# Altium project Synthdude.PrjPcb
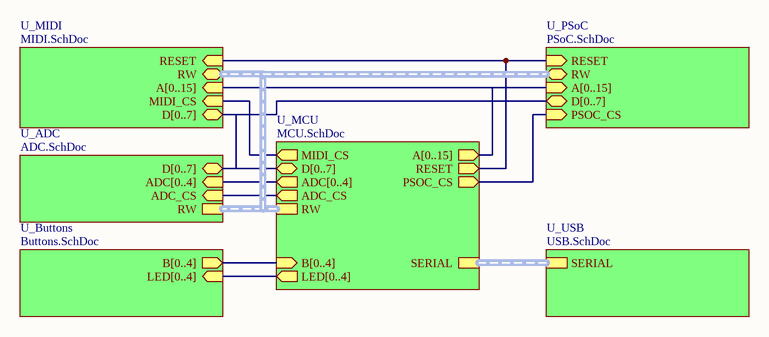
[diagram p0: Synthdude.SchDoc]
7 sheets, 124 parts. Net scope: hierarchical (ports join the sheet entries above them; power ports are global).
Board file: Synthdude.PcbDoc
Sheets:
  Synthdude.SchDoc
    U_MCU = MCU.SchDoc
    U_MIDI = MIDI.SchDoc
    U_USB = USB.SchDoc
    U_PSoC = PSoC.SchDoc
    U_Buttons = Buttons.SchDoc
    U_ADC = ADC.SchDoc

## Sheet Synthdude.SchDoc
size A; SheetNumber: 1; SheetTotal: 7

### Sub-sheets
U_ADC = ADC.SchDoc: D[0..7] (bidir), ADC[0..4] (in), RW (harness RW), ADC_CS (in)
U_Buttons = Buttons.SchDoc: B[0..4] (out), LED[0..4] (in)
U_MCU = MCU.SchDoc: D[0..7] (bidir), A[0..15] (out), SERIAL (harness UART), ADC_CS (out), MIDI_CS (out), PSOC_CS (out), RW (harness RW), ADC[0..4] (out), RESET (out), B[0..4] (in), LED[0..4] (out)
U_MIDI = MIDI.SchDoc: D[0..7] (bidir), MIDI_CS (in), A[0..15] (in), RESET (in), RW (harness RW)
U_PSoC = PSoC.SchDoc: D[0..7] (bidir), PSOC_CS (in), RESET (in), A[0..15] (in), RW (harness RW)
U_USB = USB.SchDoc: SERIAL (harness UART)

### Nets
NetU1_13: sheet U_MCU/ADC_CS, sheet U_ADC/ADC_CS
NetU8_4: sheet U_MCU/RESET, sheet U_MIDI/RESET, sheet U_PSoC/RESET
NetU13_12: sheet U_MCU/PSOC_CS, sheet U_PSoC/PSOC_CS
NetU13_13: sheet U_MCU/MIDI_CS, sheet U_MIDI/MIDI_CS

### Buses and harness runs
bus sheet U_ADC/ADC[0..4] = sheet U_MCU/ADC[0..4]
bus sheet U_ADC/D[0..7] = sheet U_MCU/D[0..7] = sheet U_MIDI/D[0..7] = sheet U_PSoC/D[0..7]
bus sheet U_Buttons/B[0..4] = sheet U_MCU/B[0..4]
bus sheet U_Buttons/LED[0..4] = sheet U_MCU/LED[0..4]
bus sheet U_MCU/A[0..15] = sheet U_MIDI/A[0..15] = sheet U_PSoC/A[0..15]
harness sheet U_ADC/RW = sheet U_MCU/RW = sheet U_MIDI/RW = sheet U_PSoC/RW
harness sheet U_MCU/SERIAL = sheet U_USB/SERIAL

## Sheet MCU.SchDoc
size A; SheetNumber: 2; SheetTotal: 7
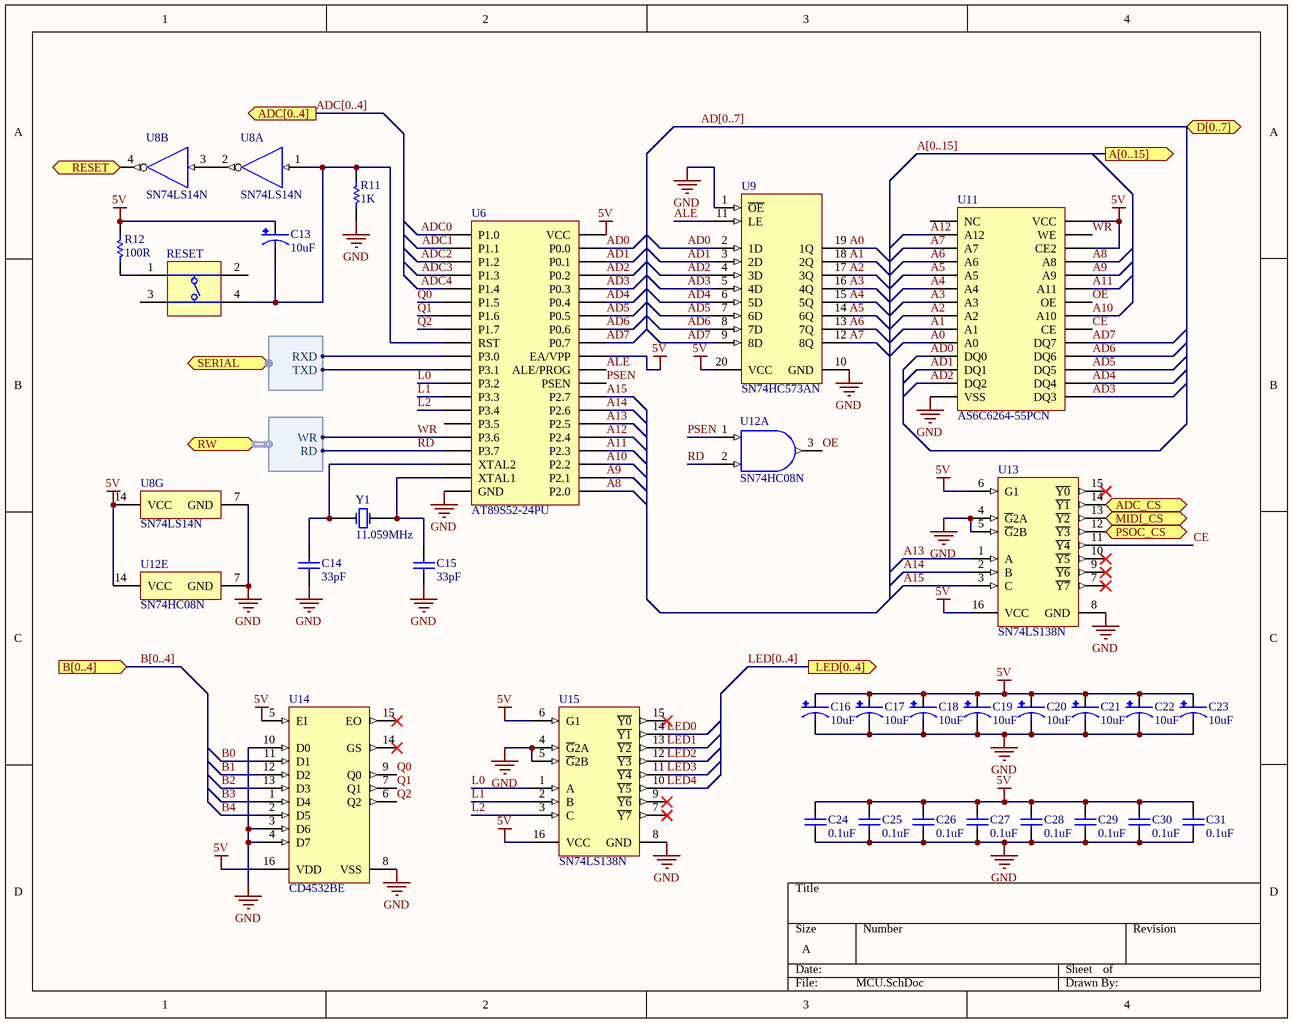
[diagram p1: MCU.SchDoc]

### Parts
C13  10uF  [CPOL-RADIAL]
C14  33pF  [CAP-PTH]
C15  33pF  [CAP-PTH]
C16  10uF  [CPOL-RADIAL]
C17  10uF  [CPOL-RADIAL]
C18  10uF  [CPOL-RADIAL]
C19  10uF  [CPOL-RADIAL]
C20  10uF  [CPOL-RADIAL]
C21  10uF  [CPOL-RADIAL]
C22  10uF  [CPOL-RADIAL]
C23  10uF  [CPOL-RADIAL]
C24  0.1uF  [CAP-PTH]
C25  0.1uF  [CAP-PTH]
C26  0.1uF  [CAP-PTH]
C27  0.1uF  [CAP-PTH]
C28  0.1uF  [CAP-PTH]
C29  0.1uF  [CAP-PTH]
C30  0.1uF  [CAP-PTH]
C31  0.1uF  [CAP-PTH]
R11  1K  [RESISTOR]
R12  100R  [RESISTOR]
RESET  (no value)  [TACTILE_SWITCH]
U6  AT89S52-24PU  [PDIP-40]
U8  SN74LS14N  [N0014A]  (parts A,B,G of 7)
U9  SN74HC573AN  [N0020A]
U11  AS6C6264-55PCN  [PDIP-28]
U12  SN74HC08N  [N0014A]  (parts A,E of 5)
U13  SN74LS138N  [N0016A]
U14  CD4532BE  [N0016A]
U15  SN74LS138N  [N0016A]
Y1  11.059MHz  [CRYSTAL_PTH]

### Ports
A[0..15] (out), ADC[0..4] (out), ADC_CS (out), B[0..4] (in), D[0..7] (bidir), LED[0..4] (out), MIDI_CS (out), PSOC_CS (out), RESET (out), RW (harness RW), SERIAL (harness UART)

### Harnesses
UART: RXD, TXD
RW: WR, RD

### Nets
5V: C13.1(+) C16.1(+) C17.1(+) C18.1(+) C19.1(+) C20.1(+) C21.1(+) C22.1(+) C23.1(+) C24.1 C25.1 C26.1 C27.1 C28.1 C29.1 C30.1 C31.1 R12.2 U6.31(EA/VPP) U6.40(VCC) U8.14(VCC) U9.20(VCC) U11.26(CE2) U11.28(VCC) U12.14(VCC) U13.6(G1) U13.16(VCC) U14.5(EI) U14.16(VDD) U15.6(G1) U15.16(VCC)
GND: C14.2 C15.2 C16.2(-) C17.2(-) C18.2(-) C19.2(-) C20.2(-) C21.2(-) C22.2(-) C23.2(-) C24.2 C25.2 C26.2 C27.2 C28.2 C29.2 C30.2 C31.2 R11.1 U6.20(GND) U8.7(GND) U9.1(~{OE}) U9.10(GND) U11.14(VSS) U12.7(GND) U13.4(~{G}2A) U13.5(~{G}2B) U13.8(GND) U14.3(D6) U14.4(D7) U14.8(VSS) U14.10(D0) U15.4(~{G}2A) U15.5(~{G}2B) U15.8(GND)
A0: U9.19(1Q) U11.10(A0)
A1: U9.18(2Q) U11.9(A1)
A2: U9.17(3Q) U11.8(A2)
A3: U9.16(4Q) U11.7(A3)
A4: U9.15(5Q) U11.6(A4)
A5: U9.14(6Q) U11.5(A5)
A6: U9.13(7Q) U11.4(A6)
A7: U9.12(8Q) U11.3(A7)
A8: U6.21(P2.0) U11.25(A8)
A9: U6.22(P2.1) U11.24(A9)
A10: U6.23(P2.2) U11.21(A10)
A11: U6.24(P2.3) U11.23(A11)
A12: U6.25(P2.4) U11.2(A12)
A13: U6.26(P2.5) U13.1(A)
A14: U6.27(P2.6) U13.2(B)
A15: U6.28(P2.7) U13.3(C)
AD0: U6.39(P0.0) U9.2(1D) U11.11(DQ0)
AD1: U6.38(P0.1) U9.3(2D) U11.12(DQ1)
AD2: U6.37(P0.2) U9.4(3D) U11.13(DQ2)
AD3: U6.36(P0.3) U9.5(4D) U11.15(DQ3)
AD4: U6.35(P0.4) U9.6(5D) U11.16(DQ4)
AD5: U6.34(P0.5) U9.7(6D) U11.17(DQ5)
AD6: U6.33(P0.6) U9.8(7D) U11.18(DQ6)
AD7: U6.32(P0.7) U9.9(8D) U11.19(DQ7)
ADC0: U6.1(P1.0)
ADC1: U6.2(P1.1)
ADC2: U6.3(P1.2)
ADC3: U6.4(P1.3)
ADC4: U6.5(P1.4)
ALE: U6.30(ALE/PROG) U9.11(LE)
B0: U14.11(D1)
B1: U14.12(D2)
B2: U14.13(D3)
B3: U14.1(D4)
B4: U14.2(D5)
CE: U11.20(CE) U13.11(~{Y4})
L0: U6.12(P3.2) U15.1(A)
L1: U6.13(P3.3) U15.2(B)
L2: U6.14(P3.4) U15.3(C)
LED0: U15.14(~{Y1})
LED1: U15.13(~{Y2})
LED2: U15.12(~{Y3})
LED3: U15.11(~{Y4})
LED4: U15.10(~{Y5})
OE: U11.22(OE) U12.3(1Y)
PSEN: U6.29(PSEN) U12.1(1A)
Q0: U6.6(P1.5) U14.9(Q0)
Q1: U6.7(P1.6) U14.7(Q1)
Q2: U6.8(P1.7) U14.6(Q2)
RD: U6.17(P3.7) U12.2(1B) ; port RW.RD
WR: U6.16(P3.6) U11.27(WE) ; port RW.WR
NetC13_2: C13.2(-) R11.2 RESET.4(T3) U6.9(RST) U8.1(1A)
NetC14_1: C14.1 U6.18(XTAL2) Y1.1(X1)
NetC15_1: C15.1 U6.19(XTAL1) Y1.2(X2)
NetR12_1: R12.1 RESET.1(T1)
NetU1_13: U13.14(~{Y1}) ; port ADC_CS
NetU6_10: U6.10(P3.0) ; port SERIAL.RXD
NetU6_11: U6.11(P3.1) ; port SERIAL.TXD
NetU8_2: U8.2(~{1Y}) U8.3(2A)
NetU8_4: U8.4(~{2Y}) ; port RESET
NetU13_12: U13.12(~{Y3}) ; port PSOC_CS
NetU13_13: U13.13(~{Y2}) ; port MIDI_CS

Not connected (* = marked no-connect by the designer): RESET 2(T2) 3(T3); U6 15(P3.5); U11 1(NC); U13 7(~{Y7})* 9(~{Y6})* 10(~{Y5})* 15(~{Y0})*; U14 14(GS)* 15(EO)*; U15 7(~{Y7})* 9(~{Y6})* 15(~{Y0})*

### Buses and harness runs
bus A[0..15] = port A[0..15]
bus AD[0..7] = port D[0..7]
bus ADC[0..4] = port ADC[0..4]
bus B[0..4] = port B[0..4]
bus LED[0..4] = port LED[0..4]

### Library data of the parts
C13 C16-C23 = PolarizedCap
C14 C15 C24-C31 = Cap
R11 R12 = Resistor
RESET = Switch: Switch, SPNO Push Button SMD
U6 = AT89S52-24PU: Manufacturer: Atmel; PartNumber: AT89S52-24PU; Mounting Technology: Through Hole; PackageReference: PDIP-40
U8 = CMP-1615-00069-3: Hex schmitt-trigger inverters, N0014A, TUBE; Manufacturer: Texas Instruments; VCC(Max)(V): 5.25; F @ Nom Voltage(Max)(Mhz): 35; Bits(#): 6; Schmitt Trigger: Yes; Rating: Catalog; Output Type: CMOS; Voltage(Nom)(V): 5; Technology Family: LS; VCC(Min)(V): 4.75; Output Drive (IOL/IOH)(Max)(mA): -0.4/8; tpd @ Nom Voltage(Max)(ns): 22; Input Type: TTL; ICC @ Nom Voltage(Max)(mA): 0.06; Code_JEDEC: MS-001; DatasheetVersion: SDLS049B; PackageReference: N0014A; Operating Temperature Range(C): 0 to 70; Generic Part Number: SN74LS14
U9 = CMP-1621-00367-2: Octal Transparent D-Type Latches With 3-State Outputs, N0020A, TUBE; Manufacturer: Texas Instruments; Rating: Catalog; ICC @ Nom Voltage(Max)(mA): 0.08; Logic: True; tpd @ Nom Voltage(Max)(ns): 38; F @ Nom Voltage(Max)(Mhz): 28; Output Logic: Non-inverted; Bits(#): 8; VCC(Max)(V): 6; Output Type: CMOS; VCC(Min)(V): 2; Technology Family: HC; Schmitt Trigger: No; 3-State Output: Yes; Output Drive (IOL/IOH)(Max)(mA): 7.8/-7.8; DatasheetVersion: SCLS147E; PackageReference: N0020A; Operating Temperature Range(C): -40 to 85; Static Current: 0.08; Code_JEDEC: MS-001; Voltage(Nom)(V): 6; Generic Part Number: SN74HC573A; Input Type: CMOS
U11 = AS6C6264-55PCN: Manufacturer: Alliance Memory, Inc.; PartNumber: AS6C6264-55PCN; Mounting Technology: Through Hole; PackageReference: PDIP-28
U12 = CMP-0777-00250-3: Quadruple 2-Input Positive-AND Gates, N0014A, TUBE; Manufacturer: Texas Instruments; Output Type: CMOS; ICC @ Nom Voltage(Max)(mA): 0.02; tpd @ Nom Voltage(Max)(ns): 28; Voltage(Nom)(V): 5; VCC(Min)(V): 2; Technology Family: HC; F @ Nom Voltage(Max)(Mhz): 70; Rating: Catalog; Bits(#): 4; Schmitt Trigger: No; VCC(Max)(V): 6; PackageReference: N0014A; Input Type: CMOS; Generic Part Number: SN74HC08; DatasheetVersion: SCLS081F; Operating Temperature Range(C): -40 to 85
U13 U15 = CMP-1633-00714-2: 3-line to 8-line decoder / demultiplexer, N0016A, TUBE; Manufacturer: Texas Instruments; Voltage(Nom)(V): 5; VCC(Min)(V): 4.75; Schmitt Trigger: No; Bits(#): 8; VCC(Max)(V): 5.25; ICC @ Nom Voltage(Max)(mA): 10; F @ Nom Voltage(Max)(Mhz): 35; Channels(#): 1; Configuration: 3：8; Technology Family: LS; Output Type: TTL; Output Drive (IOL/IOH)(Max)(mA): 8/-0.4; tpd @ Nom Voltage(Max)(ns): 41; Rating: Catalog; Operating Temperature Range(C): 0 to 70; PackageReference: N0016A; DatasheetVersion: SDLS014; Type: Standard; Generic Part Number: SN74LS138; Function: Decoder/Demultiplexer; Input Type: TTL; Code_JEDEC: MS-001
U14 = CMP-1633-00642-2: CMOS 8-Bit Priority Encoder, N0016A, TUBE; Manufacturer: Texas Instruments; Schmitt Trigger: No; Technology Family: CD4000; Rating: Catalog; Bits(#): 8; VCC(Min)(V): 3; ICC @ Nom Voltage(Max)(mA): 0.3; Function: Encoder/Multiplexer; Configuration: 8：4; Output Drive (IOL/IOH)(Max)(mA): 1.5/-1.5; tpd @ Nom Voltage(Max)(ns): 110; Channels(#): 1; VCC(Max)(V): 18; Voltage(Nom)(V): 5,10,15; Generic Part Number: CD4532B; Code_JEDEC: MS-001; F @ Nom Voltage(Max)(Mhz): 8; PackageReference: N0016A; Operating Temperature Range(C): -55 to 125; Type: Standard; DatasheetVersion: SCHS082C; Input Type: CMOS; Output Type: CMOS
Y1 = Crystal

## Sheet MIDI.SchDoc
size A; SheetNumber: 5; SheetTotal: 7
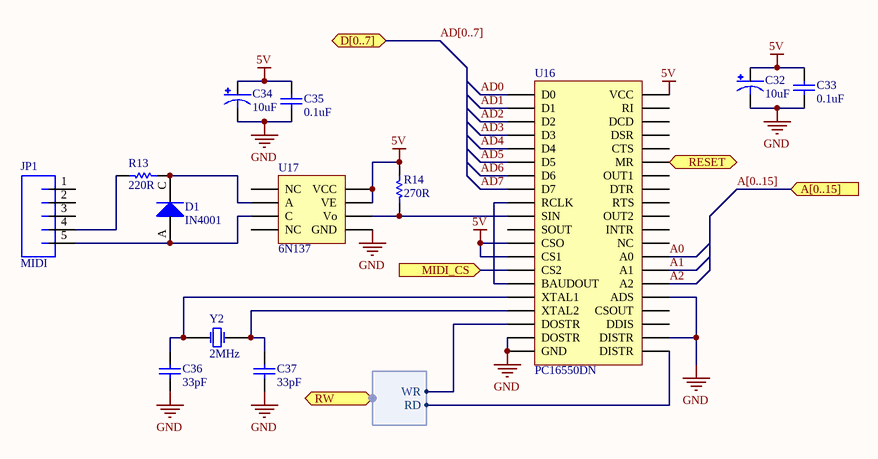
[diagram p2: MIDI.SchDoc]

### Parts
C32  10uF  [CPOL-RADIAL]
C33  0.1uF  [CAP-PTH]
C34  10uF  [CPOL-RADIAL]
C35  0.1uF  [CAP-PTH]
C36  33pF  [CAP-PTH]
C37  33pF  [CAP-PTH]
D1  IN4001  [DIODE-1N4001]
JP1  MIDI  [DIN_5_FEMALE]
R13  220R  [RESISTOR]
R14  270R  [RESISTOR]
U16  PC16550DN  [PDIP-40]
U17  6N137  [PDIP-8]
Y2  2MHz  [CRYSTAL_PTH]

### Ports
A[0..15] (in), D[0..7] (bidir), MIDI_CS (in), RESET (in), RW (harness RW)

### Harnesses
RW: WR, RD

### Nets
5V: C32.1(+) C33.1 C34.1(+) C35.1 R14.2 U16.12(CSO) U16.13(CS1) U16.40(VCC) U17.7(VE) U17.8(VCC)
GND: C32.2(-) C33.2 C34.2(-) C35.2 C36.2 C37.2 U16.19(DOSTR) U16.20(GND) U16.22(DISTR) U16.25(ADS) U17.5(GND)
A0: U16.28(A0)
A1: U16.27(A1)
A2: U16.26(A2)
AD0: U16.1(D0)
AD1: U16.2(D1)
AD2: U16.3(D2)
AD3: U16.4(D3)
AD4: U16.5(D4)
AD5: U16.6(D5)
AD6: U16.7(D6)
AD7: U16.8(D7)
RD: U16.21(DISTR) ; port RW.RD
WR: U16.18(DOSTR) ; port RW.WR
NetC36_1: C36.1 U16.16(XTAL1) Y2.1(X1)
NetC37_1: C37.1 U16.17(XTAL2) Y2.2(X2)
NetD1_A: D1.A JP1.5 U17.3(C)
NetD1_C: D1.C(K) R13.2 U17.2(A)
NetJP1_4: JP1.4 R13.1
NetR14_1: R14.1 U16.10(SIN) U17.6(Vo)
NetU8_4: U16.35(MR) ; port RESET
NetU13_13: U16.14(CS2) ; port MIDI_CS
NetU16_9: U16.9(RCLK) U16.15(BAUDOUT)

Not connected (* = marked no-connect by the designer): JP1 1 2 3; U16 11(SOUT) 23(DDIS) 24(CSOUT) 29(NC) 30(INTR) 31(OUT2) 32(RTS) 33(DTR) 34(OUT1) 36(CTS) 37(DSR) 38(DCD) 39(RI); U17 1(NC) 4(NC)

### Buses and harness runs
bus A[0..15] = port A[0..15]
bus AD[0..7] = port D[0..7]

### Library data of the parts
C32 C34 = PolarizedCap
C33 C35-C37 = Cap
R13 R14 = Resistor
U16 = PC16550DN: Manufacturer: Texas Instruments; PartNumber: PC16550DN; Mounting Technology: Through Hole; PackageReference: PDIP-40
Y2 = Crystal

## Sheet USB.SchDoc
size A; SheetNumber: 7; SheetTotal: 7
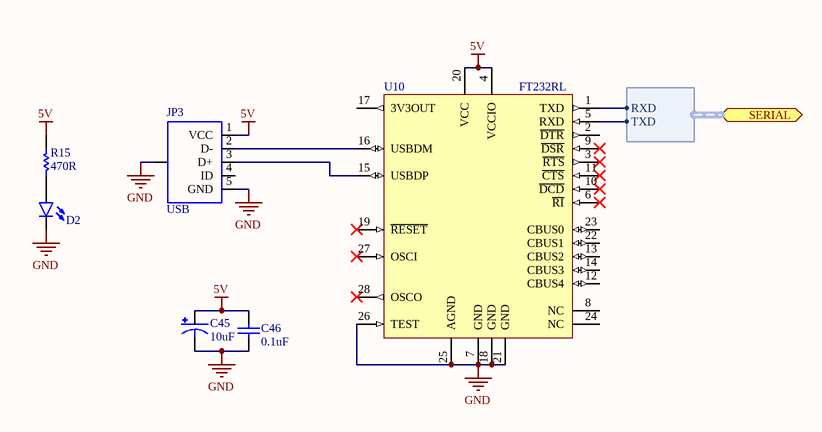
[diagram p3: USB.SchDoc]

### Parts
C45  10uF  [CPOL-RADIAL]
C46  0.1uF  [CAP-PTH]
D2  LED  [LED5MM]  (value not drawn)
JP3  USB  [USB-MICROB]
R15  470R  [RESISTOR]
U10  FT232RL  [SSOP-28_N]

### Ports
SERIAL (harness UART)

### Harnesses
UART: RXD, TXD

### Nets
5V: C45.1(+) C46.1 JP3.1(VCC) R15.1 U10.4(VCCIO) U10.20(VCC)
GND: C45.2(-) C46.2 D2.K JP3.5(GND) JP3.6(SHIELD) U10.7(GND) U10.18(GND) U10.21(GND) U10.25(AGND) U10.26(TEST)
NetD2_A: D2.A R15.2
NetJP3_2: JP3.2(D-) U10.16(USBDM)
NetJP3_3: JP3.3(D+) U10.15(USBDP)
NetU6_10: U10.1(TXD) ; port SERIAL.RXD
NetU6_11: U10.5(RXD) ; port SERIAL.TXD

Not connected (* = marked no-connect by the designer): JP3 4(ID); U10 2(~{DTR}) 3(~{RTS})* 6(~{RI})* 8(NC) 9(~{DSR})* 10(~{DCD})* 11(~{CTS})* 12(CBUS4) 13(CBUS2) 14(CBUS3) 17(3V3OUT) 19(~{RESET})* 22(CBUS1) 23(CBUS0) 24(NC) 27(OSCI)* 28(OSCO)*

### Library data of the parts
C45 = PolarizedCap
C46 = Cap
D2 = LED: PartNumber: LTST-C193TGKT-5A; Manufacturer: Lite-On Inc.; PackageReference: 0603; PackageDescription: 0603 (1608 Metric); Mounting Technology: Surface Mount
JP3 = USB_MICROB_SMT: pin to pad: 1>VBUS 2>D- 3>D+ 4>ID 5>GND 6>MT1+P$1+P$2+MT2; PartNumber: 10118192-0001LF; Manufacturer: Amphenol FCI; Mounting Technology: Surface Mount; PackageReference: USB - Micro B
R15 = Resistor
U10 = CMP-0078-00028-3: USB UART Asynchronous Serial Data Transfer Chip, 28-pin SSOP, Tube; PartNumber: FT232RL-Tube; Manufacturer: FTDI; ComponentLink1Description: Manufacturer URL; ComponentLink2URL: http://www.ftdichip.com/Support/Documents/DataSheets/ICs/DS_FT232R.pdf; PackageVersion: Mar-12; RevisionNote: DatasheetVersion updated to 2.10 Mar-2012; PackageDescription: 28-Pin Small Outline Package 0.65 mm Pitch; PackageReference: SSOP-28; DatasheetVersion: ver 2.10, Mar-2012; ComponentLink2Description: Datasheet; ComponentLink1URL: http://www.ftdichip.com/

## Sheet PSoC.SchDoc
size A; SheetNumber: 6; SheetTotal: 7
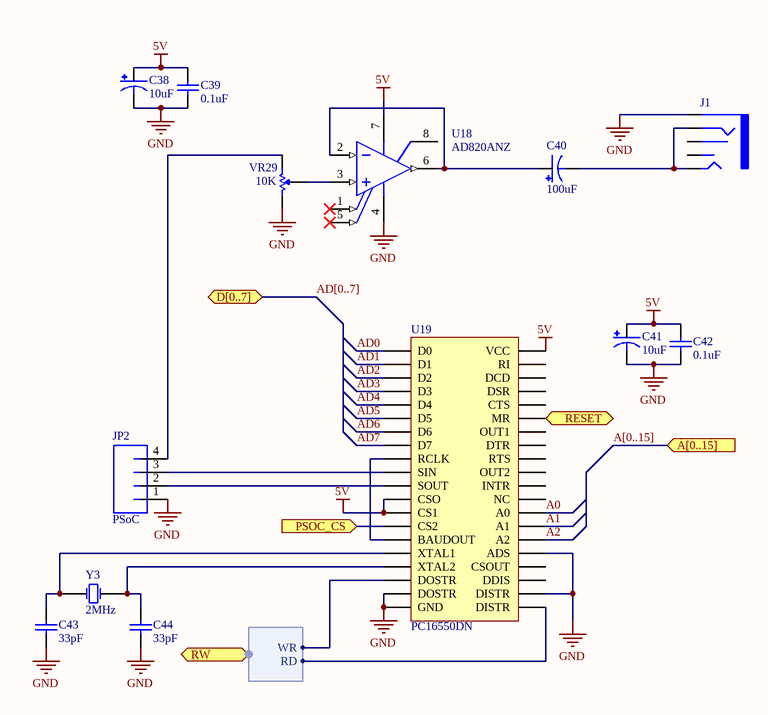
[diagram p4: PSoC.SchDoc]

### Parts
C38  10uF  [CPOL-RADIAL]
C39  0.1uF  [CAP-PTH]
C40  100uF  [CPOL-RADIAL-100UF-25V]
C41  10uF  [CPOL-RADIAL]
C42  0.1uF  [CAP-PTH]
C43  33pF  [CAP-PTH]
C44  33pF  [CAP-PTH]
J1  (no value)  [AUDIO_JACK]
JP2  PSoC  [JST-PH-4-PTH-HORZ]
U18  AD820ANZ  [ADI-N-8]
U19  PC16550DN  [PDIP-40]
VR29  10K  [ROTARY_POT]
Y3  2MHz  [CRYSTAL_PTH]

### Ports
A[0..15] (in), D[0..7] (bidir), PSOC_CS (in), RESET (in), RW (harness RW)

### Harnesses
RW: WR, RD

### Nets
5V: C38.1(+) C39.1 C41.1(+) C42.1 U18.7(+VS) U19.12(CSO) U19.13(CS1) U19.40(VCC)
GND: C38.2(-) C39.2 C41.2(-) C42.2 C43.2 C44.2 J1.SLEEVE JP2.1 U18.4(-VS) U19.19(DOSTR) U19.20(GND) U19.22(DISTR) U19.25(ADS) VR29.3
A0: U19.28(A0)
A1: U19.27(A1)
A2: U19.26(A2)
AD0: U19.1(D0)
AD1: U19.2(D1)
AD2: U19.3(D2)
AD3: U19.4(D3)
AD4: U19.5(D4)
AD5: U19.6(D5)
AD6: U19.7(D6)
AD7: U19.8(D7)
RD: U19.21(DISTR) ; port RW.RD
WR: U19.18(DOSTR) ; port RW.WR
NetC40_1: C40.1(+) U18.2(-IN) U18.6(VOUT)
NetC40_2: C40.2(-) J1.RING J1.TIP
NetC43_1: C43.1 U19.16(XTAL1) Y3.1(X1)
NetC44_1: C44.1 U19.17(XTAL2) Y3.2(X2)
NetJP2_2: JP2.2 U19.11(SOUT)
NetJP2_3: JP2.3 U19.10(SIN)
NetJP2_4: JP2.4 VR29.1
NetU8_4: U19.35(MR) ; port RESET
NetU13_12: U19.14(CS2) ; port PSOC_CS
NetU18_3: U18.3(+IN) VR29.2
NetU19_9: U19.9(RCLK) U19.15(BAUDOUT)

Not connected (* = marked no-connect by the designer): J1 RSH TSH; U18 1(NULL)* 5(NULL)* 8(NC); U19 23(DDIS) 24(CSOUT) 29(NC) 30(INTR) 31(OUT2) 32(RTS) 33(DTR) 34(OUT1) 36(CTS) 37(DSR) 38(DCD) 39(RI)

### Buses and harness runs
bus A[0..15] = port A[0..15]
bus AD[0..7] = port D[0..7]

### Library data of the parts
C38 C41 = PolarizedCap
C39 C42-C44 = Cap
C40 = PolarizedCap-100uF
J1 = AudioJack
JP2 = JST_PH_4_HORZ: PartNumber: S4B-PH-K-S(LF)(SN); Manufacturer: JST Sales America Inc.; PackageReference: JST-PH; Mounting Technology: Through Hole
U18 = CMP-0384-00229-1: Single Channel Rail-to-Rail Operational Amplifier, 1.9 MHz BW, 3 V/us SR, Industrial, 8-pin DIP (N-8), Tube; Manufacturer: Analog Devices; Generic Part Number: AD820; Small Signal Bandwidth: 1.9MHz; V Span Min: 5V; Amplifiers Per Package: 1; V Span Max: 36V; Input Offset Voltage: 100uV; Slew Rate: 3V/us; Input Bias Current: 2pA; Iq/Amp: 900uA; ComponentLink2Description: Datasheet; PackageReference: N-8; Code_JEDEC: MS-001; PartNumber: AD820ANZ; PackageVersion: 070606-A; ComponentLink1URL: http://www.analog.com/en/index.html; PackageDescription: 8-Pin Plastic Dual In-Line Package, Row spacing 7.62 mm, Pitch 2.54 mm; DatasheetVersion: Rev. H; ComponentLink3URL: http:/www.analog.com/static/imported-files/packages/PKG_PDF/PDIP(N)/N_8.pdf; ComponentLink2URL: http://www.analog.com/static/imported-files/data_sheets/AD820.pdf; Mounting Technology: Through Hole; ComponentLink3Description: Package Specification; ComponentLink1Description: Manufacturer URL
U19 = PC16550DN: Manufacturer: Texas Instruments; PartNumber: PC16550DN; Mounting Technology: Through Hole; PackageReference: PDIP-40
VR29 = RotaryPot
Y3 = Crystal

## Sheet Buttons.SchDoc
size A; SheetNumber: 4; SheetTotal: 7
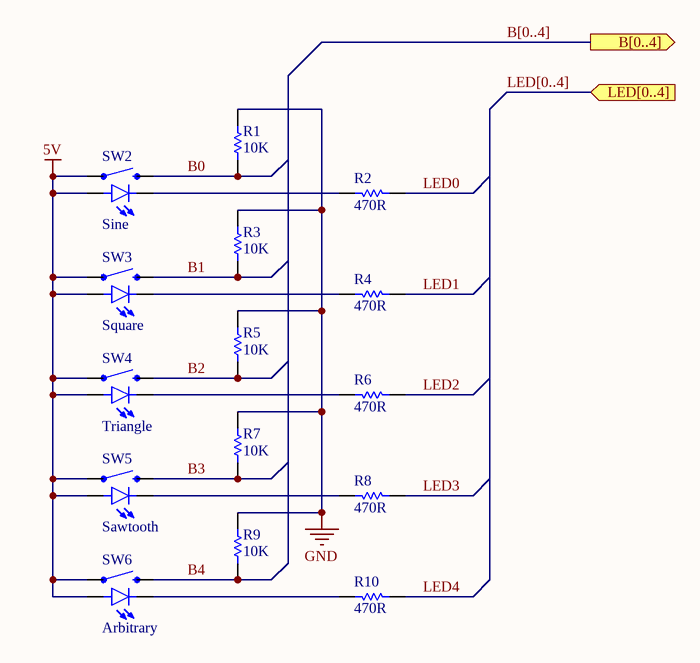
[diagram p5: Buttons.SchDoc]

### Parts
R1  10K  [RESISTOR]
R2  470R  [RESISTOR]
R3  10K  [RESISTOR]
R4  470R  [RESISTOR]
R5  10K  [RESISTOR]
R6  470R  [RESISTOR]
R7  10K  [RESISTOR]
R8  470R  [RESISTOR]
R9  10K  [RESISTOR]
R10  470R  [RESISTOR]
SW2  Sine  [TACTILE-PTH-LED]
SW3  Square  [TACTILE-PTH-LED]
SW4  Triangle  [TACTILE-PTH-LED]
SW5  Sawtooth  [TACTILE-PTH-LED]
SW6  Arbitrary  [TACTILE-PTH-LED]

### Ports
B[0..4] (out), LED[0..4] (in)

### Nets
5V: SW2.4 SW2.A SW3.4 SW3.A SW4.4 SW4.A SW5.4 SW5.A SW6.4 SW6.A
GND: R1.1 R3.1 R5.1 R7.1 R9.1
B0: R1.2 SW2.2
B1: R3.2 SW3.2
B2: R5.2 SW4.2
B3: R7.2 SW5.2
B4: R9.2 SW6.2
LED0: R2.1
LED1: R4.1
LED2: R6.1
LED3: R8.1
LED4: R10.1
NetR2_2: R2.2 SW2.C
NetR4_2: R4.2 SW3.C
NetR6_2: R6.2 SW4.C
NetR8_2: R8.2 SW5.C
NetR10_2: R10.2 SW6.C

### Buses and harness runs
bus B[0..4] = port B[0..4]
bus LED[0..4] = port LED[0..4]

### Library data of the parts
R1-R10 = Resistor
SW2-SW6 = SwitchLED

## Sheet ADC.SchDoc
size A; SheetNumber: 3; SheetTotal: 7
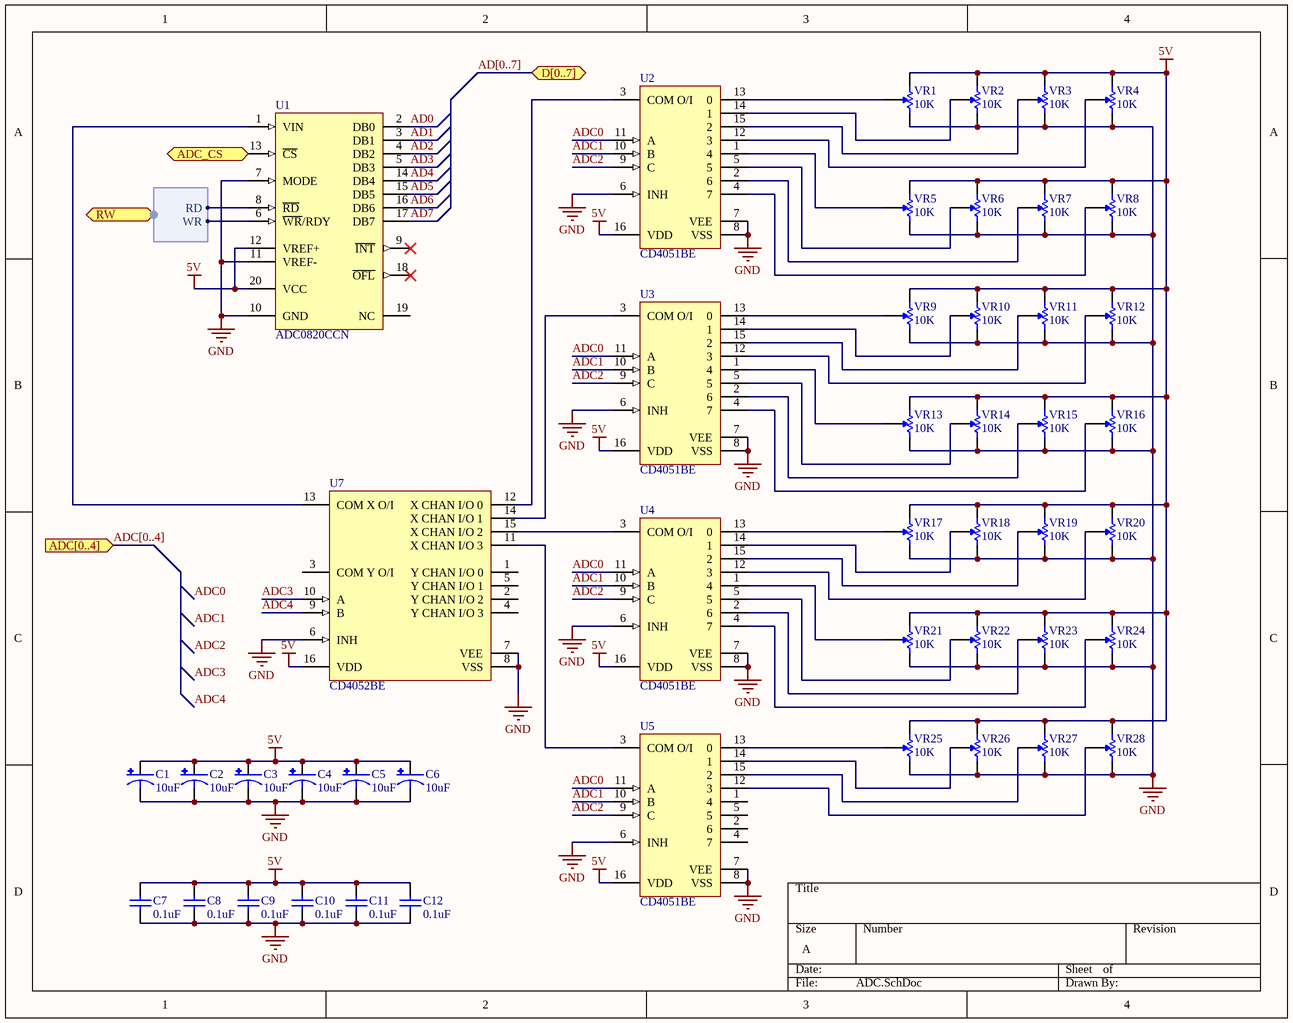
[diagram p6: ADC.SchDoc]

### Parts
C1  10uF  [CPOL-RADIAL]
C2  10uF  [CPOL-RADIAL]
C3  10uF  [CPOL-RADIAL]
C4  10uF  [CPOL-RADIAL]
C5  10uF  [CPOL-RADIAL]
C6  10uF  [CPOL-RADIAL]
C7  0.1uF  [CAP-PTH]
C8  0.1uF  [CAP-PTH]
C9  0.1uF  [CAP-PTH]
C10  0.1uF  [CAP-PTH]
C11  0.1uF  [CAP-PTH]
C12  0.1uF  [CAP-PTH]
U1  ADC0820CCN  [N20A]
U2  CD4051BE  [N0016A]
U3  CD4051BE  [N0016A]
U4  CD4051BE  [N0016A]
U5  CD4051BE  [N0016A]
U7  CD4052BE  [N0016A]
VR1  10K  [LINEAR_POT]
VR2  10K  [LINEAR_POT]
VR3  10K  [LINEAR_POT]
VR4  10K  [LINEAR_POT]
VR5  10K  [LINEAR_POT]
VR6  10K  [LINEAR_POT]
VR7  10K  [LINEAR_POT]
VR8  10K  [LINEAR_POT]
VR9  10K  [LINEAR_POT]
VR10  10K  [LINEAR_POT]
VR11  10K  [LINEAR_POT]
VR12  10K  [LINEAR_POT]
VR13  10K  [LINEAR_POT]
VR14  10K  [LINEAR_POT]
VR15  10K  [LINEAR_POT]
VR16  10K  [LINEAR_POT]
VR17  10K  [LINEAR_POT]
VR18  10K  [LINEAR_POT]
VR19  10K  [LINEAR_POT]
VR20  10K  [LINEAR_POT]
VR21  10K  [LINEAR_POT]
VR22  10K  [LINEAR_POT]
VR23  10K  [LINEAR_POT]
VR24  10K  [LINEAR_POT]
VR25  10K  [ROTARY_POT]
VR26  10K  [ROTARY_POT]
VR27  10K  [ROTARY_POT]
VR28  10K  [ROTARY_POT]

### Ports
ADC[0..4] (in), ADC_CS (in), D[0..7] (bidir), RW (harness RW)

### Harnesses
RW: WR, RD

### Nets
5V: C1.1(+) C2.1(+) C3.1(+) C4.1(+) C5.1(+) C6.1(+) C7.1 C8.1 C9.1 C10.1 C11.1 C12.1 U1.12(VREF+) U1.20(VCC) U2.16(VDD) U3.16(VDD) U4.16(VDD) U5.16(VDD) U7.16(VDD) VR1.1 VR2.1 VR3.1 VR4.1 VR5.1 VR6.1 VR7.1 VR8.1 VR9.1 VR10.1 VR11.1 VR12.1 VR13.1 VR14.1 VR15.1 VR16.1 VR17.1 VR18.1 VR19.1 VR20.1 VR21.1 VR22.1 VR23.1 VR24.1 VR25.1 VR26.1 VR27.1 VR28.1
GND: C1.2(-) C2.2(-) C3.2(-) C4.2(-) C5.2(-) C6.2(-) C7.2 C8.2 C9.2 C10.2 C11.2 C12.2 U1.7(MODE) U1.10(GND) U1.11(VREF-) U2.6(INH) U2.7(VEE) U2.8(VSS) U3.6(INH) U3.7(VEE) U3.8(VSS) U4.6(INH) U4.7(VEE) U4.8(VSS) U5.6(INH) U5.7(VEE) U5.8(VSS) U7.6(INH) U7.7(VEE) U7.8(VSS) VR1.3 VR2.3 VR3.3 VR4.3 VR5.3 VR6.3 VR7.3 VR8.3 VR9.3 VR10.3 VR11.3 VR12.3 VR13.3 VR14.3 VR15.3 VR16.3 VR17.3 VR18.3 VR19.3 VR20.3 VR21.3 VR22.3 VR23.3 VR24.3 VR25.3 VR26.3 VR27.3 VR28.3
AD0: U1.2(DB0)
AD1: U1.3(DB1)
AD2: U1.4(DB2)
AD3: U1.5(DB3)
AD4: U1.14(DB4)
AD5: U1.15(DB5)
AD6: U1.16(DB6)
AD7: U1.17(DB7)
ADC0: U2.11(A) U3.11(A) U4.11(A) U5.11(A)
ADC1: U2.10(B) U3.10(B) U4.10(B) U5.10(B)
ADC2: U2.9(C) U3.9(C) U4.9(C) U5.9(C)
ADC3: U7.10(A)
ADC4: U7.9(B)
RD: U1.8(~{RD}) ; port RW.RD
WR: U1.6(~{WR}/RDY) ; port RW.WR
NetU1_1: U1.1(VIN) U7.13(COM_X_O/I)
NetU1_13: U1.13(~{CS}) ; port ADC_CS
NetU2_1: U2.1(4) VR5.2
NetU2_2: U2.2(6) VR7.2
NetU2_3: U2.3(COM_O/I) U7.12(X_CHAN_I/O_0)
NetU2_4: U2.4(7) VR8.2
NetU2_5: U2.5 VR6.2
NetU2_12: U2.12(3) VR4.2
NetU2_13: U2.13(0) VR1.2
NetU2_14: U2.14(1) VR2.2
NetU2_15: U2.15(2) VR3.2
NetU3_1: U3.1(4) VR13.2
NetU3_2: U3.2(6) VR15.2
NetU3_3: U3.3(COM_O/I) U7.14(X_CHAN_I/O_1)
NetU3_4: U3.4(7) VR16.2
NetU3_5: U3.5 VR14.2
NetU3_12: U3.12(3) VR12.2
NetU3_13: U3.13(0) VR9.2
NetU3_14: U3.14(1) VR10.2
NetU3_15: U3.15(2) VR11.2
NetU4_1: U4.1(4) VR21.2
NetU4_2: U4.2(6) VR23.2
NetU4_3: U4.3(COM_O/I) U7.15(X_CHAN_I/O_2)
NetU4_4: U4.4(7) VR24.2
NetU4_5: U4.5 VR22.2
NetU4_12: U4.12(3) VR20.2
NetU4_13: U4.13(0) VR17.2
NetU4_14: U4.14(1) VR18.2
NetU4_15: U4.15(2) VR19.2
NetU5_3: U5.3(COM_O/I) U7.11(X_CHAN_I/O_3)
NetU5_12: U5.12(3) VR28.2
NetU5_13: U5.13(0) VR25.2
NetU5_14: U5.14(1) VR26.2
NetU5_15: U5.15(2) VR27.2

Not connected (* = marked no-connect by the designer): U1 9(~{INT})* 18(~{OFL})* 19(NC); U5 1(4) 2(6) 4(7) 5; U7 1(Y_CHAN_I/O_0) 2(Y_CHAN_I/O_2) 3(COM_Y_O/I) 4(Y_CHAN_I/O_3) 5(Y_CHAN_I/O_1)

### Buses and harness runs
bus AD[0..7] = port D[0..7]
bus ADC[0..4] = port ADC[0..4]

### Notes on the sheet
- Labels drawn without touching a wire or pin: ADC0, ADC1, ADC2, ADC3, ADC4

### Library data of the parts
C1-C6 = PolarizedCap
C7-C12 = Cap
U1 = CMP-0054-00020-2: 8-Bit High Speed uP Compatible A/D Converter with Track/Hold Function, 20-pin MDIP; Manufacturer: National Semiconductor; PowerWise: N; CompType: ADC IC; PackageTopMarking: NSUZXYYTTE#*ADC0820CCN; ComponentLink1URL: http://www.national.com/ds/AD/ADC0820.pdf; PinCount: 20; DatasheetVersion: May-1998; Code_JEDEC: MS-001-AD; ComponentLink2URL: http://www.national.com/pf/AD/ADC0820.html; PackageDescription: Molded Dip (N) 20 Lead; ComponentLink3URL: http://www.national.com/packaging/folders/n20a.html; PackageReference: N20A; ComponentLink2Description: ADC0820 Web Page; RevisionNote: Component URLs added; RoHS: N; PackageVersion: revG, Nov-1984; ComponentLink1Description: ADC0820 Datasheet; ComponentLink3Description: N20A Package Page
U2-U5 = CMP-1575-00059-4: CMOS Single 8-Channel Analog Multiplexer/Demultiplexer with Logic-Level Conversion, N0016A, TUBE; Manufacturer: Texas Instruments; VCC(Max)(V): 18; ICC(Typ)(mA): 0.00008; Output Drive (IOL/IOH)(Max)(mA): 1; Bandwidth(Max)(MHz): 20; Rating: Military; VCC(Min)(V): 5; Configuration: 1 X 1：8 MUX; Crosstalk: Yes; Ron(Max)(Ohms): 240; Ron(Typ)(Ohms): 125; DatasheetVersion: SCHS047G; Output Type: CMOS; PackageVersion: http://www.ti.com/lit/ml/mpdi002c/mpdi002c.pdf; Operating Temperature Range(C): -55 to 125; Generic Part Number: CD4051B; PackageReference: N0016A; Code_JEDEC: MS-001
U7 = CMP-1575-00066-4: CMOS Differential 4-Channel Analog Multiplexer/Demultiplexer with Logic-Level Conversion, N0016A, TUBE; Manufacturer: Texas Instruments; Bandwidth(Max)(MHz): 25; Ron(Typ)(Ohms): 125; Rating: Catalog; Crosstalk: Yes; VCC(Max)(V): 18; ICC(Typ)(mA): 0.00008; Ron(Max)(Ohms): 240; VCC(Min)(V): 5; Configuration: 2 X 1：4 MUX; Code_JEDEC: MS-001; PackageVersion: http://www.ti.com/lit/ml/mpdi002c/mpdi002c.pdf; DatasheetVersion: SCHS047G; Generic Part Number: CD4052B; Output Type: CMOS; Operating Temperature Range(C): -55 to 125; PackageReference: N0016A
VR1-VR24 = LinearPot
VR25-VR28 = RotaryPot

## Nets that join several sheets
5V: MCU (31 pins), MIDI (10 pins), USB (6 pins), PSoC (8 pins), Buttons (10 pins), ADC (47 pins)
GND: MCU (35 pins), MIDI (11 pins), USB (10 pins), PSoC (14 pins), Buttons (5 pins), ADC (58 pins)
A0: MCU (U9.19 U11.10), MIDI (U16.28), PSoC (U19.28)
A1: MCU (U9.18 U11.9), MIDI (U16.27), PSoC (U19.27)
A2: MCU (U9.17 U11.8), MIDI (U16.26), PSoC (U19.26)
AD0: MCU (U6.39 U9.2 U11.11), MIDI (U16.1), PSoC (U19.1), ADC (U1.2)
AD1: MCU (U6.38 U9.3 U11.12), MIDI (U16.2), PSoC (U19.2), ADC (U1.3)
AD2: MCU (U6.37 U9.4 U11.13), MIDI (U16.3), PSoC (U19.3), ADC (U1.4)
AD3: MCU (U6.36 U9.5 U11.15), MIDI (U16.4), PSoC (U19.4), ADC (U1.5)
AD4: MCU (U6.35 U9.6 U11.16), MIDI (U16.5), PSoC (U19.5), ADC (U1.14)
AD5: MCU (U6.34 U9.7 U11.17), MIDI (U16.6), PSoC (U19.6), ADC (U1.15)
AD6: MCU (U6.33 U9.8 U11.18), MIDI (U16.7), PSoC (U19.7), ADC (U1.16)
AD7: MCU (U6.32 U9.9 U11.19), MIDI (U16.8), PSoC (U19.8), ADC (U1.17)
ADC0: MCU (U6.1), ADC (U2.11 U3.11 U4.11 U5.11)
ADC1: MCU (U6.2), ADC (U2.10 U3.10 U4.10 U5.10)
ADC2: MCU (U6.3), ADC (U2.9 U3.9 U4.9 U5.9)
ADC3: MCU (U6.4), ADC (U7.10)
ADC4: MCU (U6.5), ADC (U7.9)
B0: MCU (U14.11), Buttons (R1.2 SW2.2)
B1: MCU (U14.12), Buttons (R3.2 SW3.2)
B2: MCU (U14.13), Buttons (R5.2 SW4.2)
B3: MCU (U14.1), Buttons (R7.2 SW5.2)
B4: MCU (U14.2), Buttons (R9.2 SW6.2)
LED0: MCU (U15.14), Buttons (R2.1)
LED1: MCU (U15.13), Buttons (R4.1)
LED2: MCU (U15.12), Buttons (R6.1)
LED3: MCU (U15.11), Buttons (R8.1)
LED4: MCU (U15.10), Buttons (R10.1)
NetU1_13: MCU (U13.14), ADC (U1.13)
NetU6_10: MCU (U6.10), USB (U10.1)
NetU6_11: MCU (U6.11), USB (U10.5)
NetU8_4: MCU (U8.4), MIDI (U16.35), PSoC (U19.35)
NetU13_12: MCU (U13.12), PSoC (U19.14)
NetU13_13: MCU (U13.13), MIDI (U16.14)
RD: MCU (U6.17 U12.2), MIDI (U16.21), PSoC (U19.21), ADC (U1.8)
WR: MCU (U6.16 U11.27), MIDI (U16.18), PSoC (U19.18), ADC (U1.6)